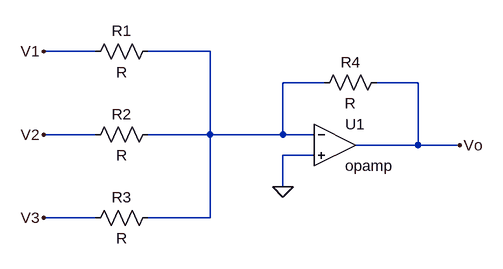
[diagram p0: schematic Sumador.asc]
Sumador.asc, the LTspice schematic file:
Version 4.1
SHEET 1 880 680
WIRE 80 80 0 80
WIRE 256 80 160 80
WIRE 432 128 368 128
WIRE 576 128 512 128
WIRE 80 208 0 208
WIRE 256 208 256 80
WIRE 256 208 160 208
WIRE 368 208 368 128
WIRE 368 208 256 208
WIRE 416 208 368 208
WIRE 576 224 576 128
WIRE 576 224 480 224
WIRE 640 224 576 224
WIRE 416 240 368 240
WIRE 368 288 368 240
WIRE 80 336 0 336
WIRE 256 336 256 208
WIRE 256 336 160 336
FLAG 368 288 0
FLAG 0 80 V1
FLAG 0 208 V2
FLAG 0 336 V3
FLAG 640 224 Vo
SYMBOL res 176 64 R90
WINDOW 0 0 56 VBottom 2
WINDOW 3 32 56 VTop 2
SYMATTR InstName R1
SYMBOL res 176 192 R90
WINDOW 0 0 56 VBottom 2
WINDOW 3 32 56 VTop 2
SYMATTR InstName R2
SYMBOL res 176 320 R90
WINDOW 0 0 56 VBottom 2
WINDOW 3 32 56 VTop 2
SYMATTR InstName R3
SYMBOL OpAmps\\opamp 448 160 R0
SYMATTR InstName U1
SYMBOL res 528 112 R90
WINDOW 0 0 56 VBottom 2
WINDOW 3 32 56 VTop 2
SYMATTR InstName R4

The netlist it stands for:
* Sumador.asc
R1 N001 V1 R
R2 N001 V2 R
R3 N001 V3 R
X§U1 N001 0 Vo opamp Aol=100K GBW=10Meg  ; pins invin noninvin out
R4 Vo N001 R
.backanno
.end